# EAGLE schematic uTTA_V1_SystemDrawings (EAGLE 6.3)
VERSION: V4.0

## Sheet 1 of 3: System Architecture
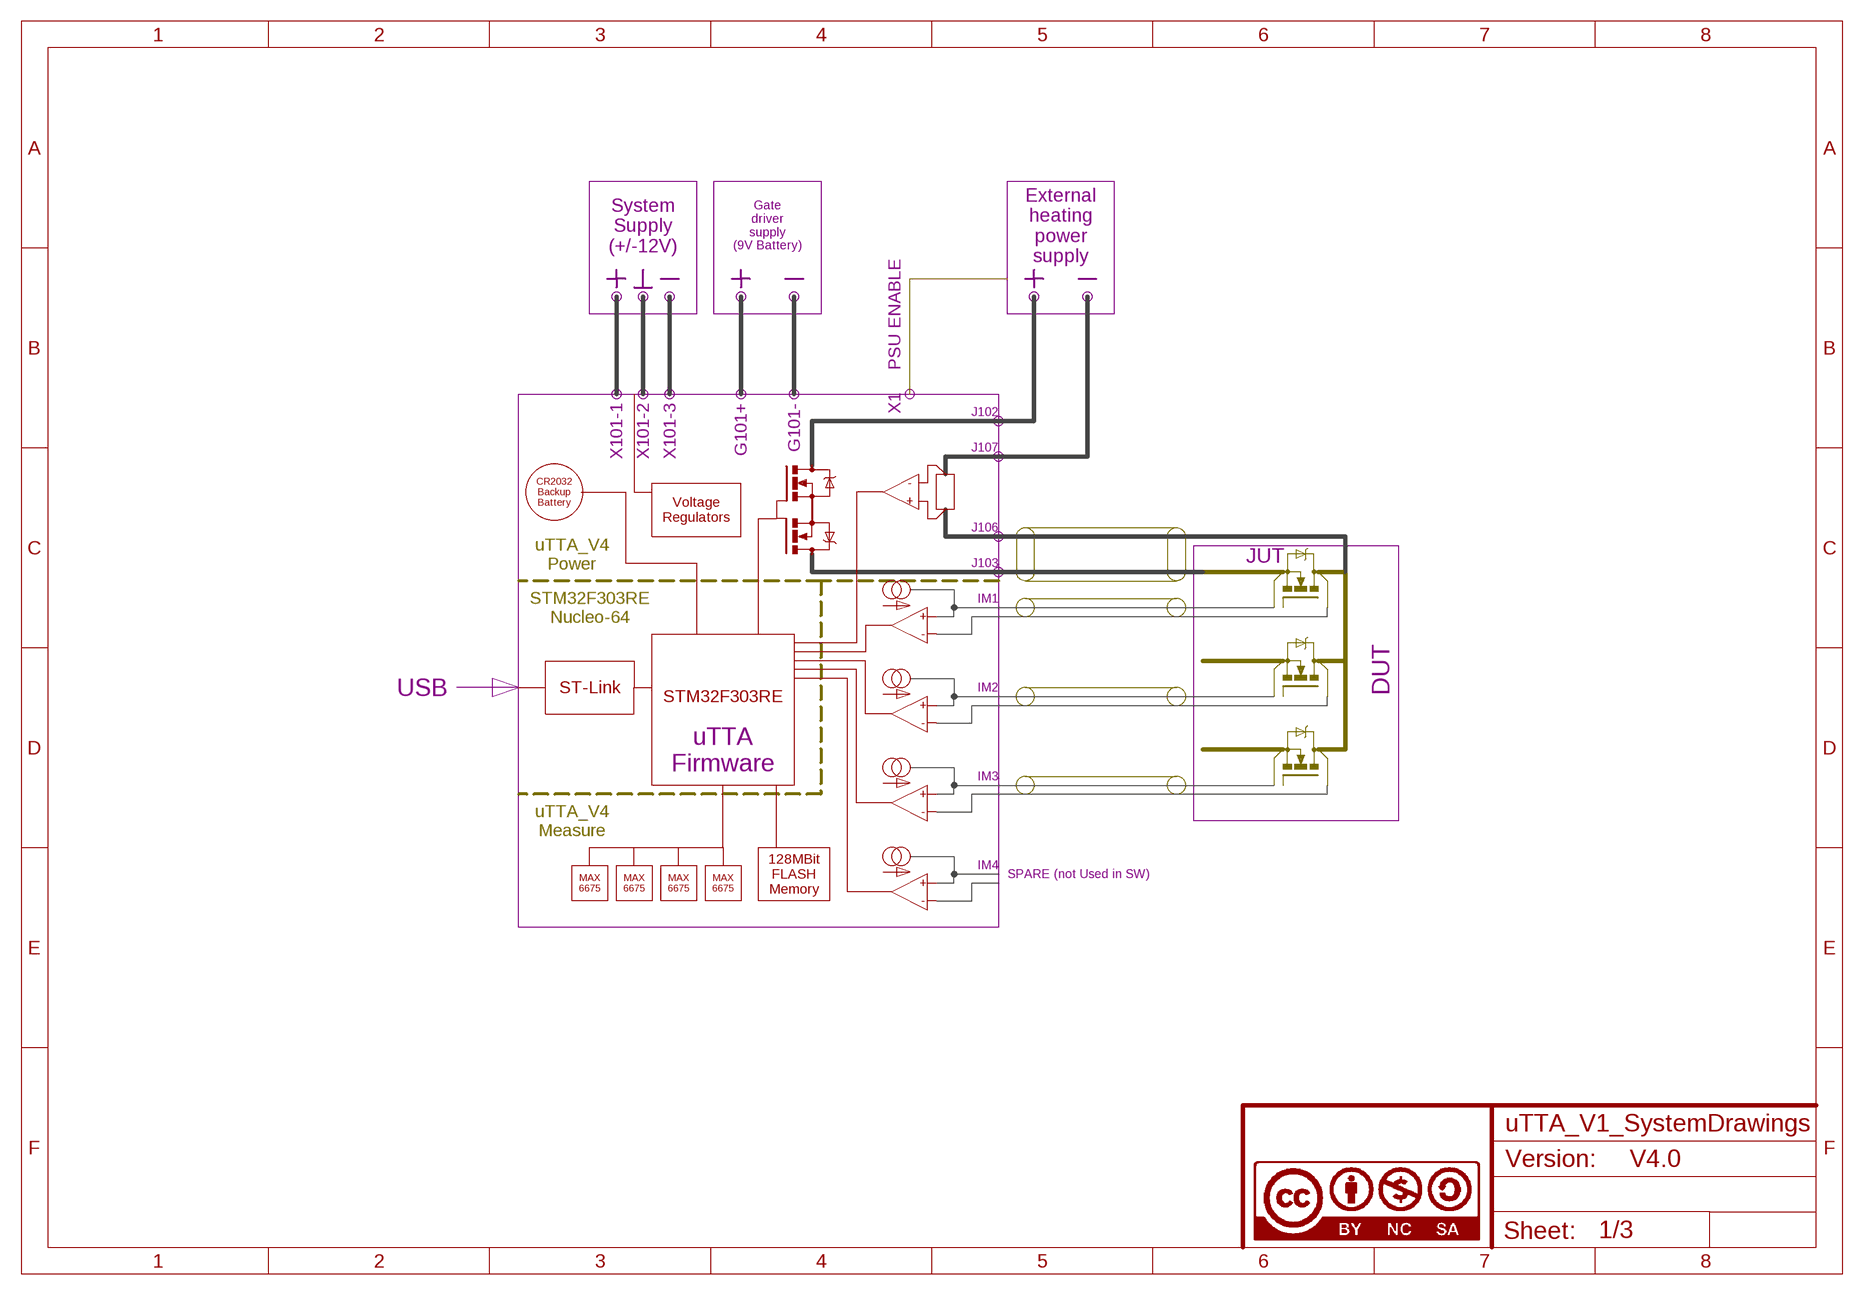
[diagram p0: schematic, sheet 1]

### Parts
U$4  A4L-LOC_CC_BY_NC_SA  [A4_LOC_CC_BY_NC_SA]

### Notes on the sheet
- System
  Supply
  (+/-12V)
- Gate
  driver
  supply
  (9V Battery)
- External
  heating
  power
  supply
- PSU ENABLE
- X101-1 | X101-2 | X101-3 | G101+ | G101- | X1
- J102
- J107
- -
- CR2032
  Backup
  Battery
- +
- Voltage
  Regulators
- J106
- uTTA_V4
  Power
- J103 | JUT
- IM1
- STM32F303RE
  Nucleo-64
- +
- -
- DUT
- USB | ST-Link | IM2
- STM32F303RE
- +
- -
- uTTA
  Firmware
- IM3
- +
- -
- uTTA_V4
  Measure
- IM4
- 128MBit
  FLASH
  Memory
- SPARE (not Used in SW)
- MAX
  6675
- MAX
  6675
- MAX
  6675
- MAX
  6675
- +
- -

## Sheet 2 of 3: Heating Current Circuit
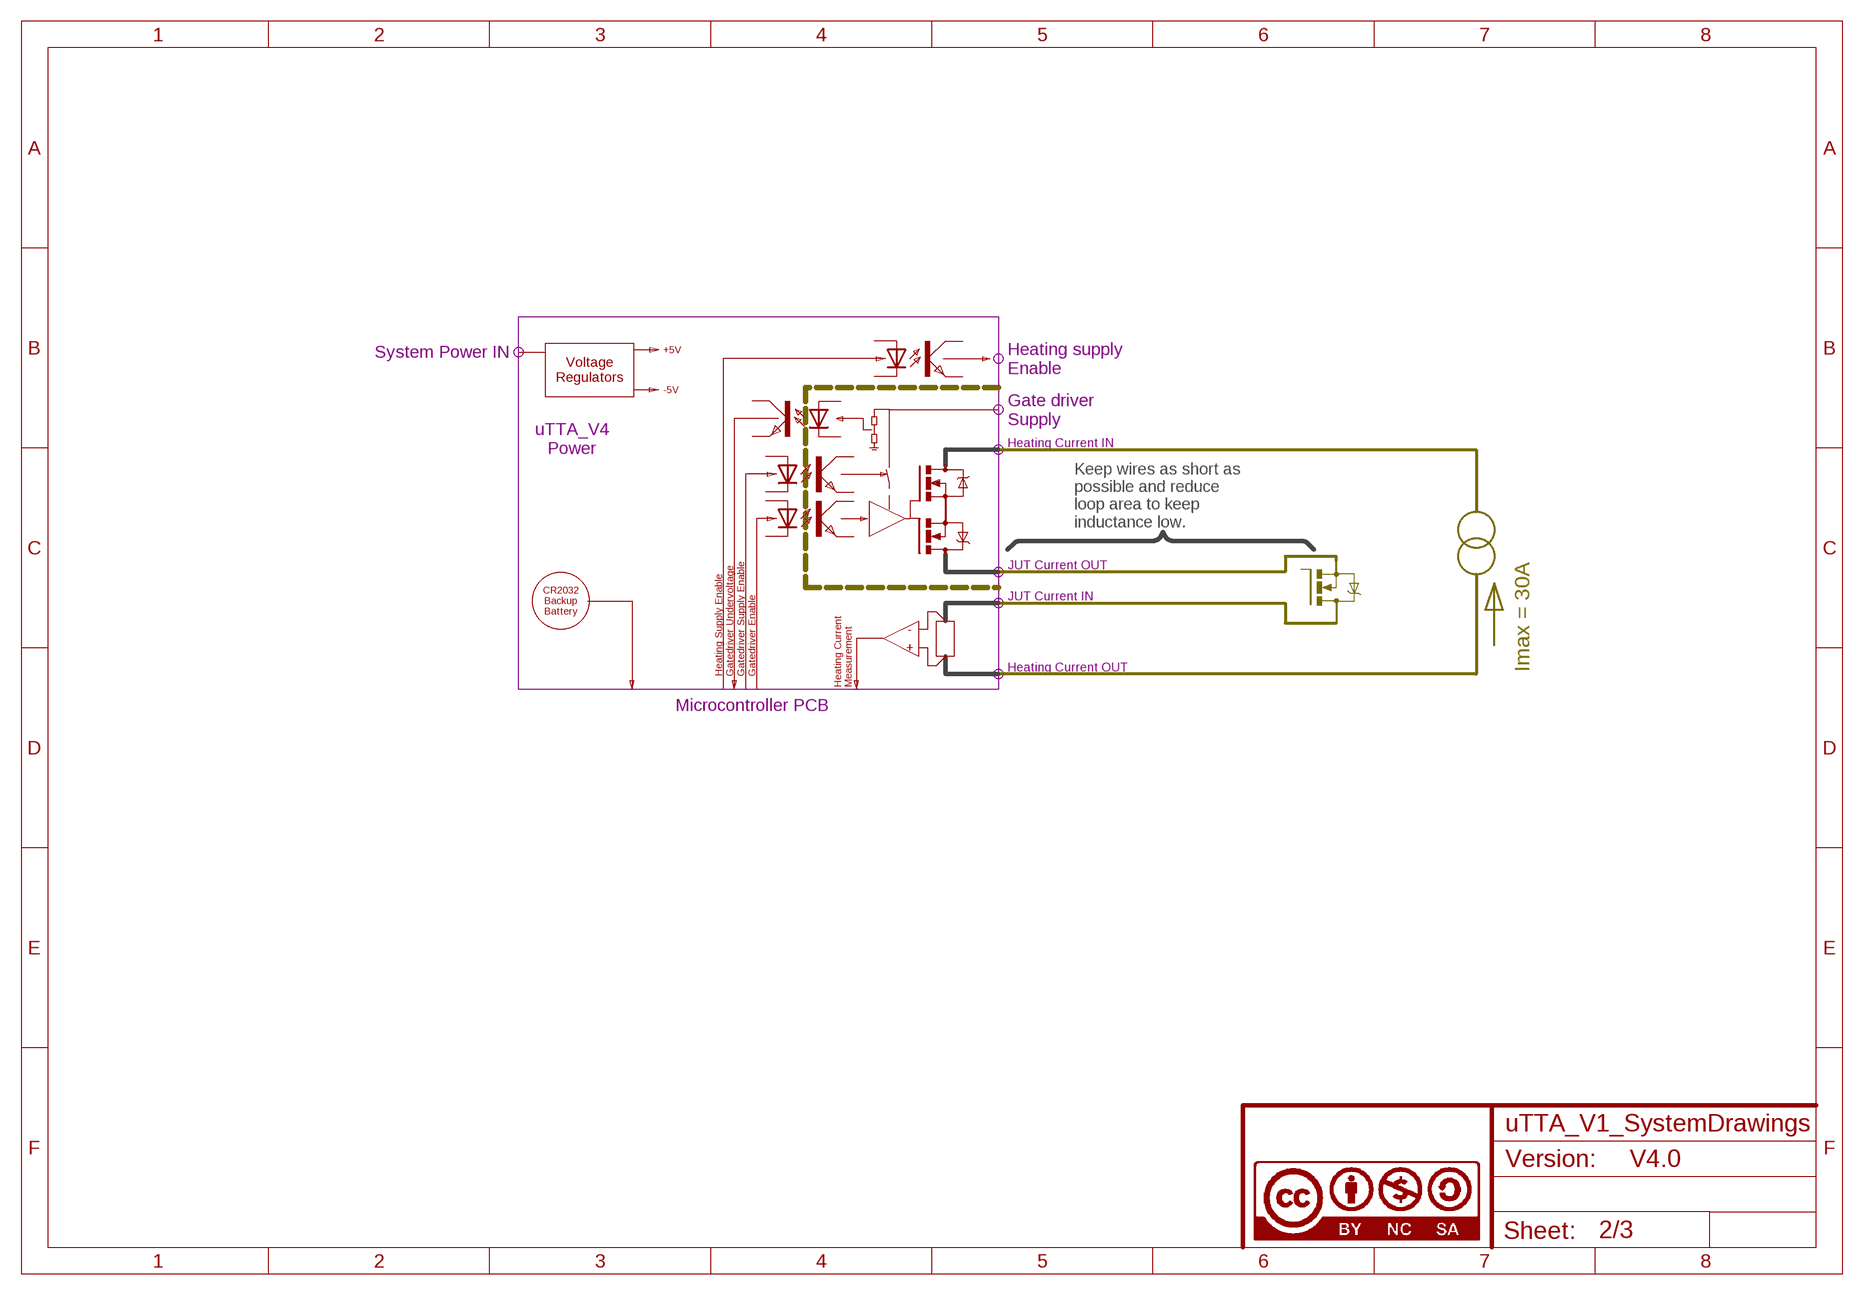
[diagram p1: schematic, sheet 2]

### Parts
U$6  A4L-LOC_CC_BY_NC_SA  [A4_LOC_CC_BY_NC_SA]

### Notes on the sheet
- System Power IN | +5V
- Heating supply
  Enable
- Voltage
  Regulators
- -5V
- Gate driver
  Supply
- uTTA_V4
  Power
- Heating Current IN
- Keep wires as short as 
  possible and reduce 
  loop area to keep 
  inductance low.
- JUT Current OUT
- JUT Current IN
- CR2032
  Backup
  Battery
- -
- +
- Heating Current OUT
- Imax = 30A
- Heating Supply Enable | Gatedriver Undervoltage | Gatedriver Supply Enable | Gatedriver Enable
- Heating Current
  Measurement
- Microcontroller PCB

## Sheet 3 of 3: Measurement Channels
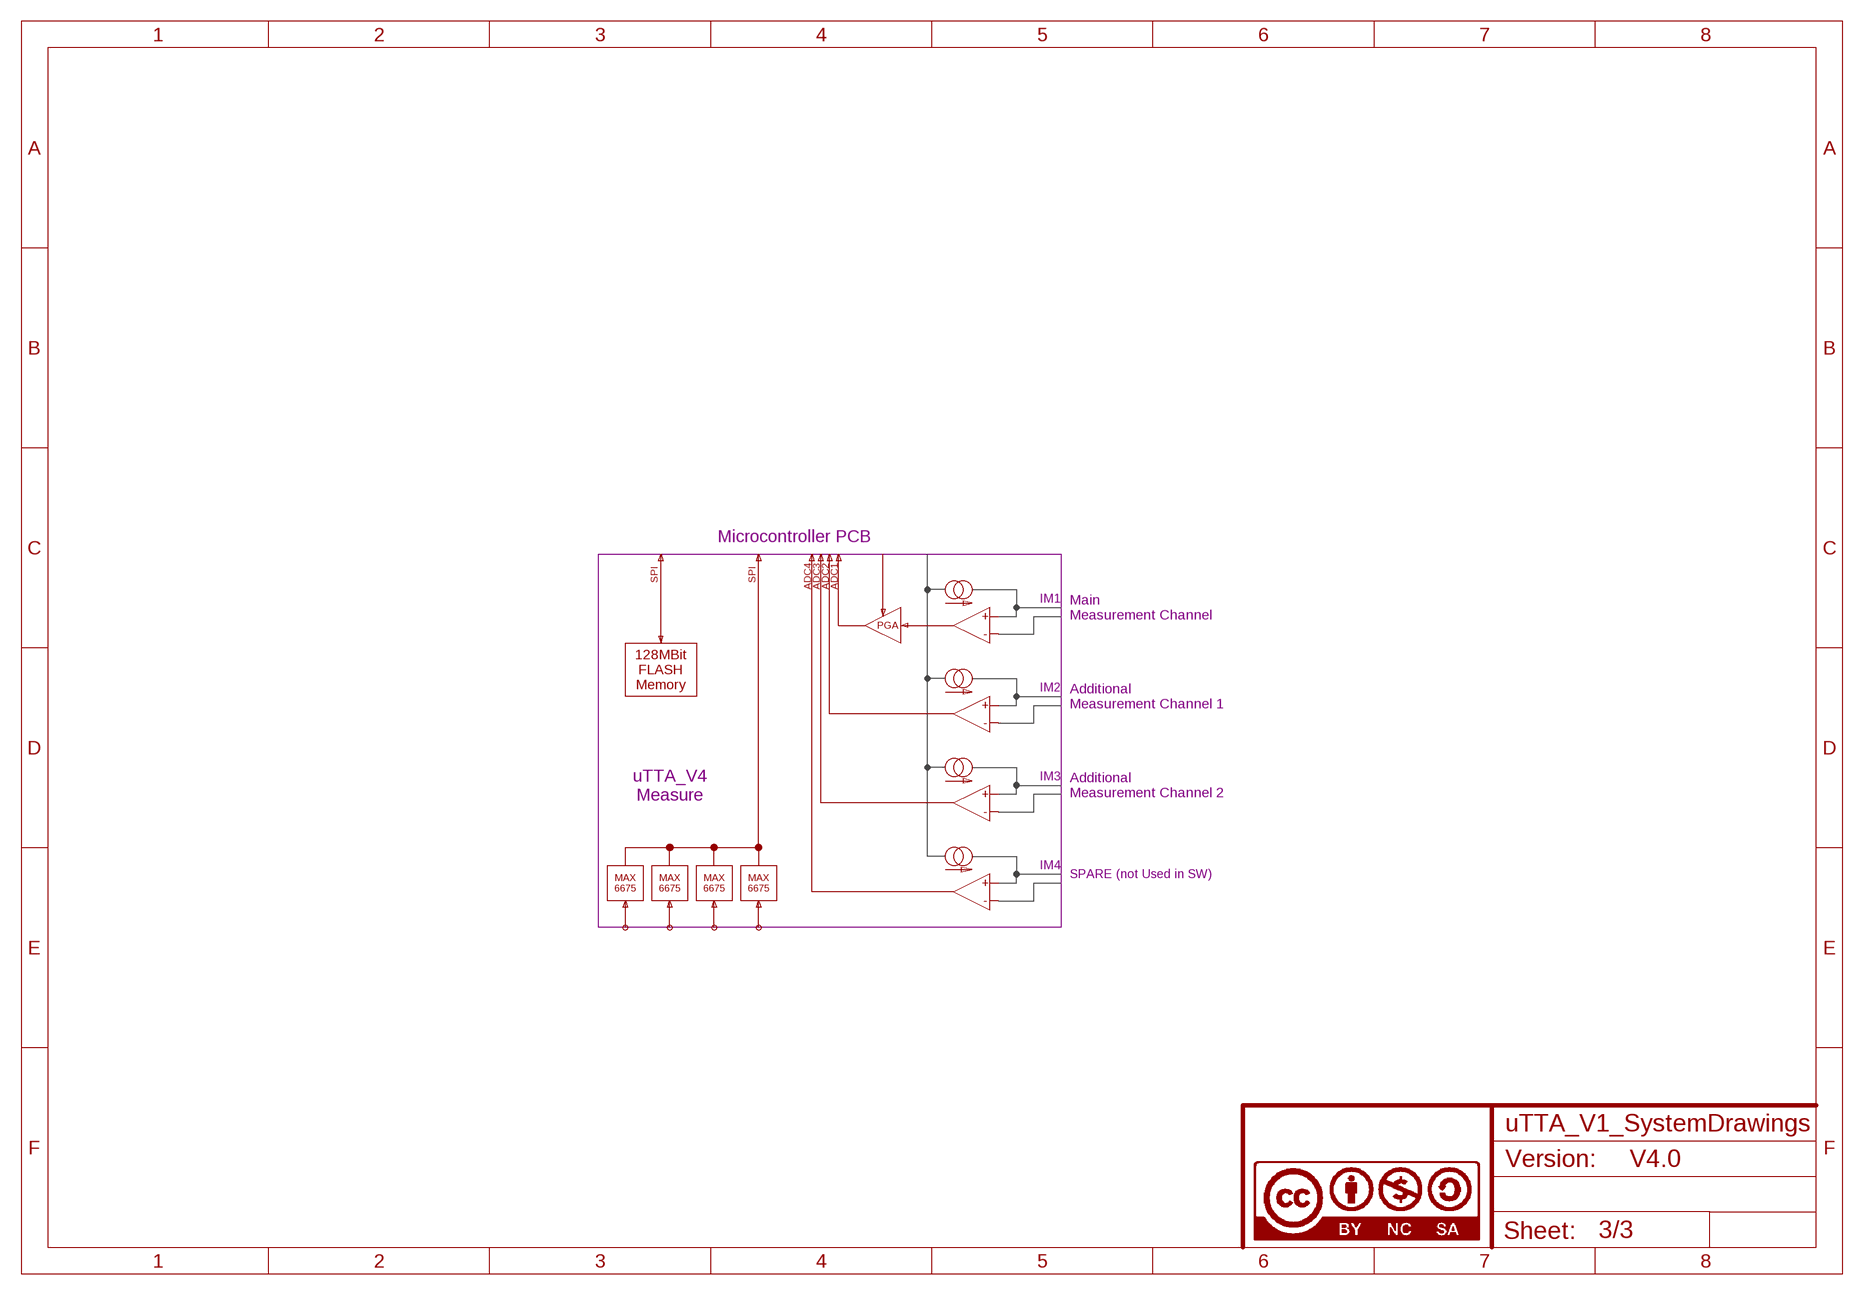
[diagram p2: schematic, sheet 3]

### Parts
U$5  A4L-LOC_CC_BY_NC_SA  [A4_LOC_CC_BY_NC_SA]

### Notes on the sheet
- Microcontroller PCB
- ADC4 | ADC3 | ADC2 | ADC1
- SPI | SPI
- IM1
- Main
  Measurement Channel
- +
- PGA
- -
- 128MBit
  FLASH
  Memory
- IM2
- Additional
  Measurement Channel 1
- +
- -
- IM3
- uTTA_V4
  Measure
- Additional
  Measurement Channel 2
- +
- -
- IM4
- SPARE (not Used in SW)
- MAX
  6675
- MAX
  6675
- MAX
  6675
- MAX
  6675
- +
- -

## Library data of the parts
U$4-U$6 = WK_frames:A4L-LOC_CC_BY_NC_SA

## Net classes
0 default: width 0.305 mm, drill 0.3 mm, clearance 0.2 mm
1 Analog_Sig: width 0.305 mm, drill 0.3 mm, clearance 0.4 mm to class 0, clearance 0.3 mm
2 Digital_Sig: width 0.305 mm, drill 0.3 mm, clearance 0.25 mm to class 0, clearance 0.4 mm to class 1, clearance 0.3 mm
3 Analog_Diff: width 0.406 mm, drill 0.3 mm, clearance 0.5 mm to class 0, clearance 0.5 mm to class 1, clearance 0.5 mm to class 2, clearance 0.4 mm